# EAGLE schematic temp-stellwerk-a-2 (EAGLE 9.6.2)
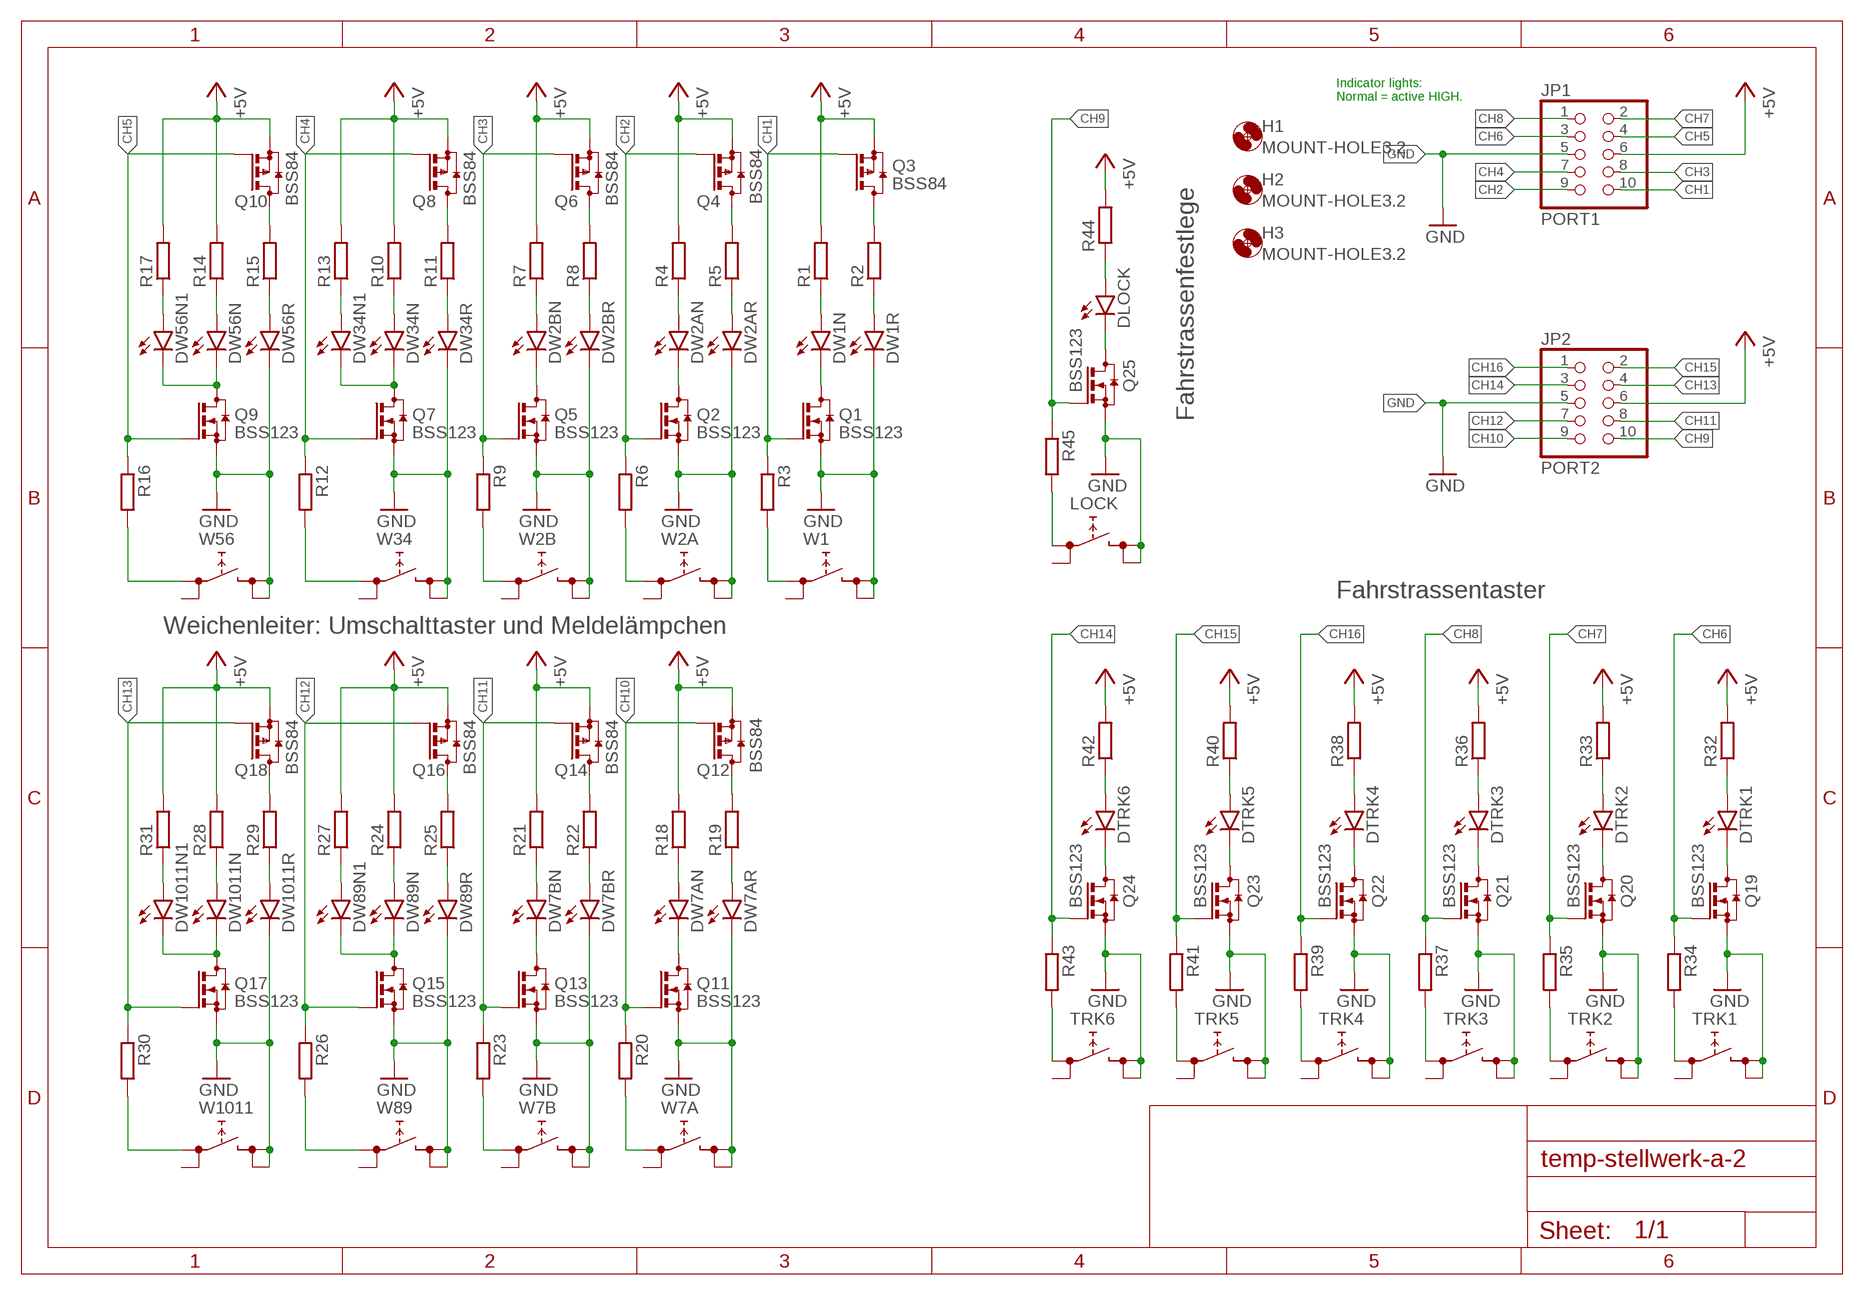
[diagram p0: schematic, sheet 1]

## Parts
DLOCK  LEDCHIP-LED0805  [CHIP-LED0805]
DTRK1  LEDCHIP-LED0805  [CHIP-LED0805]
DTRK2  LEDCHIP-LED0805  [CHIP-LED0805]
DTRK3  LEDCHIP-LED0805  [CHIP-LED0805]
DTRK4  LEDCHIP-LED0805  [CHIP-LED0805]
DTRK5  LEDCHIP-LED0805  [CHIP-LED0805]
DTRK6  LEDCHIP-LED0805  [CHIP-LED0805]
DW1N  LEDCHIP-LED0603  [CHIP-LED0603]
DW1R  LEDCHIP-LED0603  [CHIP-LED0603]
DW2AN  LEDCHIP-LED0603  [CHIP-LED0603]
DW2AR  LEDCHIP-LED0603  [CHIP-LED0603]
DW2BN  LEDCHIP-LED0805  [CHIP-LED0805]
DW2BR  LEDCHIP-LED0805  [CHIP-LED0805]
DW7AN  LEDCHIPLED_0603  [CHIPLED_0603]
DW7AR  LEDCHIP-LED0603  [CHIP-LED0603]
DW7BN  LEDCHIP-LED0805  [CHIP-LED0805]
DW7BR  LEDCHIP-LED0805  [CHIP-LED0805]
DW34N  LEDCHIP-LED0805  [CHIP-LED0805]
DW34N1  LEDCHIP-LED0805  [CHIP-LED0805]
DW34R  LEDCHIP-LED0805  [CHIP-LED0805]
DW56N  LEDCHIP-LED0805  [CHIP-LED0805]
DW56N1  LEDCHIP-LED0805  [CHIP-LED0805]
DW56R  LEDCHIP-LED0805  [CHIP-LED0805]
DW89N  LEDCHIP-LED0805  [CHIP-LED0805]
DW89N1  LEDCHIP-LED0805  [CHIP-LED0805]
DW89R  LEDCHIP-LED0805  [CHIP-LED0805]
DW1011N  LEDCHIP-LED0805  [CHIP-LED0805]
DW1011N1  LEDCHIP-LED0805  [CHIP-LED0805]
DW1011R  LEDCHIP-LED0805  [CHIP-LED0805]
H1  MOUNT-HOLE3.2  [3,2]
H2  MOUNT-HOLE3.2  [3,2]
H3  MOUNT-HOLE3.2  [3,2]
JP1  PORT1  PINHD-2X5CN  [CON10M]
JP2  PORT2  PINHD-2X5CN  [CON10M]
LOCK  LOCK  TACTSW-6X6S  [TACTSW-6X6]
Q1  BSS123  [SOT23]
Q2  BSS123  [SOT23]
Q3  BSS84  [SOT23]
Q4  BSS84  [SOT23]
Q5  BSS123  [SOT23]
Q6  BSS84  [SOT23]
Q7  BSS123  [SOT23]
Q8  BSS84  [SOT23]
Q9  BSS123  [SOT23]
Q10  BSS84  [SOT23]
Q11  BSS123  [SOT23]
Q12  BSS84  [SOT23]
Q13  BSS123  [SOT23]
Q14  BSS84  [SOT23]
Q15  BSS123  [SOT23]
Q16  BSS84  [SOT23]
Q17  BSS123  [SOT23]
Q18  BSS84  [SOT23]
Q19  BSS123  [SOT23]
Q20  BSS123  [SOT23]
Q21  BSS123  [SOT23]
Q22  BSS123  [SOT23]
Q23  BSS123  [SOT23]
Q24  BSS123  [SOT23]
Q25  BSS123  [SOT23]
R1  R-EU_R0805  [R0805]
R2  R-EU_R0805  [R0805]
R3  R-EU_R0805  [R0805]
R4  R-EU_R0805  [R0805]
R5  R-EU_R0805  [R0805]
R6  R-EU_R0805  [R0805]
R7  R-EU_R0805  [R0805]
R8  R-EU_R0805  [R0805]
R9  R-EU_R0805  [R0805]
R10  R-EU_R0805  [R0805]
R11  R-EU_R0805  [R0805]
R12  R-EU_R0805  [R0805]
R13  R-EU_R0805  [R0805]
R14  R-EU_R0805  [R0805]
R15  R-EU_R0805  [R0805]
R16  R-EU_R0805  [R0805]
R17  R-EU_R0805  [R0805]
R18  R-EU_R0805  [R0805]
R19  R-EU_R0805  [R0805]
R20  R-EU_R0805  [R0805]
R21  R-EU_R0805  [R0805]
R22  R-EU_R0805  [R0805]
R23  R-EU_R0805  [R0805]
R24  R-EU_R0805  [R0805]
R25  R-EU_R0805  [R0805]
R26  R-EU_R0805  [R0805]
R27  R-EU_R0805  [R0805]
R28  R-EU_R0805  [R0805]
R29  R-EU_R0805  [R0805]
R30  R-EU_R0805  [R0805]
R31  R-EU_R0805  [R0805]
R32  R-EU_R0805  [R0805]
R33  R-EU_R0805  [R0805]
R34  R-EU_R0805  [R0805]
R35  R-EU_R0805  [R0805]
R36  R-EU_R0805  [R0805]
R37  R-EU_R0805  [R0805]
R38  R-EU_R0805  [R0805]
R39  R-EU_R0805  [R0805]
R40  R-EU_R0805  [R0805]
R41  R-EU_R0805  [R0805]
R42  R-EU_R0805  [R0805]
R43  R-EU_R0805  [R0805]
R44  R-EU_R0805  [R0805]
R45  R-EU_R0805  [R0805]
TRK1  TACTSW-6X6S  [TACTSW-6X6]
TRK2  TACTSW-6X6S  [TACTSW-6X6]
TRK3  TACTSW-6X6S  [TACTSW-6X6]
TRK4  TACTSW-6X6S  [TACTSW-6X6]
TRK5  TACTSW-6X6S  [TACTSW-6X6]
TRK6  TACTSW-6X6S  [TACTSW-6X6]
W1  W1  TACTSW-6X6S  [TACTSW-6X6]
W2A  TACTSW-6X6S  [TACTSW-6X6]
W2B  TACTSW-6X6S  [TACTSW-6X6]
W7A  TACTSW-6X6S  [TACTSW-6X6]
W7B  TACTSW-6X6S  [TACTSW-6X6]
W34  XOVER  TACTSW-6X6S  [TACTSW-6X6]
W56  XOVER  TACTSW-6X6S  [TACTSW-6X6]
W89  XOVER  TACTSW-6X6S  [TACTSW-6X6]
W1011  XOVER  TACTSW-6X6S  [TACTSW-6X6]

## Nets
+5V: JP1.6 JP2.6 Q3.2(S) Q4.2(S) Q6.2(S) Q8.2(S) Q10.2(S) Q12.2(S) Q14.2(S) Q16.2(S) Q18.2(S) R1.2 R4.2 R7.2 R10.2 R13.2 R14.2 R17.2 R18.2 R21.2 R24.2 R27.2 R28.2 R31.2 R32.2 R33.2 R36.2 R38.2 R40.2 R42.2 R44.2
CH1: JP1.10 Q1.1(G) Q3.1(G) R3.1
CH2: JP1.9 Q2.1(G) Q4.1(G) R6.1
CH3: JP1.8 Q5.1(G) Q6.1(G) R9.1
CH4: JP1.7 Q7.1(G) Q8.1(G) R12.1
CH5: JP1.4 Q9.1(G) Q10.1(G) R16.1
CH6: JP1.3 Q19.1(G) R34.1
CH7: JP1.2 Q20.1(G) R35.1
CH8: JP1.1 Q21.1(G) R37.1
CH9: JP2.10 Q25.1(G) R45.1
CH10: JP2.9 Q11.1(G) Q12.1(G) R20.1
CH11: JP2.8 Q13.1(G) Q14.1(G) R23.1
CH12: JP2.7 Q15.1(G) Q16.1(G) R26.1
CH13: JP2.4 Q17.1(G) Q18.1(G) R30.1
CH14: JP2.3 Q24.1(G) R43.1
CH15: JP2.2 Q23.1(G) R41.1
CH16: JP2.1 Q22.1(G) R39.1
GND: DW1R.C DW2AR.C DW2BR.C DW7AR.C DW7BR.C DW34R.C DW56R.C DW89R.C DW1011R.C JP1.5 JP2.5 LOCK.3(2.1) LOCK.4(2.2) Q1.2(S) Q2.2(S) Q5.2(S) Q7.2(S) Q9.2(S) Q11.2(S) Q13.2(S) Q15.2(S) Q17.2(S) Q19.2(S) Q20.2(S) Q21.2(S) Q22.2(S) Q23.2(S) Q24.2(S) Q25.2(S) TRK1.3(2.1) TRK1.4(2.2) TRK2.3(2.1) TRK2.4(2.2) TRK3.3(2.1) TRK3.4(2.2) TRK4.3(2.1) TRK4.4(2.2) TRK5.3(2.1) TRK5.4(2.2) TRK6.3(2.1) TRK6.4(2.2) W1.3(2.1) W1.4(2.2) W2A.3(2.1) W2A.4(2.2) W2B.3(2.1) W2B.4(2.2) W7A.3(2.1) W7A.4(2.2) W7B.3(2.1) W7B.4(2.2) W34.3(2.1) W34.4(2.2) W56.3(2.1) W56.4(2.2) W89.3(2.1) W89.4(2.2) W1011.3(2.1) W1011.4(2.2)
N$1: DTRK1.C Q19.3(D)
N$2: DW1N.C Q1.3(D)
N$3: DW1N.A R1.1
N$4: DW1R.A R2.1
N$5: Q3.3(D) R2.2
N$6: DW2AN.C Q2.3(D)
N$8: R3.2 W1.1(1.1)
N$9: DW2AN.A R4.1
N$10: DW2AR.A R5.1
N$11: Q4.3(D) R5.2
N$13: R6.2 W2A.1(1.1)
N$14: DW2BN.C Q5.3(D)
N$15: DW2BN.A R7.1
N$16: DW2BR.A R8.1
N$17: Q6.3(D) R8.2
N$19: R9.2 W2B.1(1.1)
N$20: DW56N.A R14.1
N$21: DW34N.A R10.1
N$22: DW34R.A R11.1
N$23: Q8.3(D) R11.2
N$25: R12.2 W34.1(1.1)
N$26: DW34N1.C DW34N.C Q7.3(D)
N$27: DW34N1.A R13.1
N$28: DW56R.A R15.1
N$29: Q10.3(D) R15.2
N$31: R16.2 W56.1(1.1)
N$32: DW56N1.C DW56N.C Q9.3(D)
N$33: DW56N1.A R17.1
N$34: DW7AN.C Q11.3(D)
N$35: DW7AN.A R18.1
N$36: DW7AR.A R19.1
N$37: Q12.3(D) R19.2
N$39: R20.2 W7A.1(1.1)
N$40: DW7BN.C Q13.3(D)
N$41: DW7BN.A R21.1
N$42: DW7BR.A R22.1
N$43: Q14.3(D) R22.2
N$45: R23.2 W7B.1(1.1)
N$46: DW89N.A R24.1
N$47: DW89R.A R25.1
N$48: Q16.3(D) R25.2
N$50: R26.2 W89.1(1.1)
N$51: DW89N1.C DW89N.C Q15.3(D)
N$52: DW89N1.A R27.1
N$53: DW1011N.A R28.1
N$54: DW1011R.A R29.1
N$55: Q18.3(D) R29.2
N$57: R30.2 W1011.1(1.1)
N$58: DW1011N1.C DW1011N.C Q17.3(D)
N$59: DW1011N1.A R31.1
N$60: DTRK1.A R32.1
N$61: DTRK2.C Q20.3(D)
N$62: DTRK2.A R33.1
N$64: R34.2 TRK1.1(1.1)
N$66: R35.2 TRK2.1(1.1)
N$67: DTRK3.C Q21.3(D)
N$68: DTRK3.A R36.1
N$70: R37.2 TRK3.1(1.1)
N$71: DTRK4.C Q22.3(D)
N$72: DTRK4.A R38.1
N$74: R39.2 TRK4.1(1.1)
N$75: DTRK5.C Q23.3(D)
N$76: DTRK5.A R40.1
N$78: R41.2 TRK5.1(1.1)
N$79: DTRK6.C Q24.3(D)
N$80: DTRK6.A R42.1
N$82: R43.2 TRK6.1(1.1)
N$83: DLOCK.C Q25.3(D)
N$84: DLOCK.A R44.1
N$86: LOCK.1(1.1) R45.2
Unconnected: LOCK.2(1.2) TRK1.2(1.2) TRK2.2(1.2) TRK3.2(1.2) TRK4.2(1.2) TRK5.2(1.2) TRK6.2(1.2) W1.2(1.2) W2A.2(1.2) W2B.2(1.2) W7A.2(1.2) W7B.2(1.2) W34.2(1.2) W56.2(1.2) W89.2(1.2) W1011.2(1.2)

## Notes on the sheet
- Indicator lights:
  Normal = active HIGH.
- Fahrstrassenfestlege
- Fahrstrassentaster
- Weichenleiter: Umschalttaster und Meldelämpchen

## Library data of the parts
DLOCK DTRK1-DTRK6 DW1N DW1R DW2AN DW2AR DW2BN DW2BR DW7AN DW7AR DW7BN DW7BR DW34N DW34N1 DW34R DW56N DW56N1 DW56R DW89N DW89N1 DW89R DW1011N DW1011N1 DW1011R = led:LED: LED OSRAM: - CHIPLED LG R971, LG N971, LY N971, LG Q971, LY Q971, LO R971, LY R971 LH N974, LH R974 LS Q976, LO Q976, LY Q976 LO Q996 - Hyper CHIPLED LW Q18S LB Q993, LB Q99A, LB R99A - SideLED LS A670, LO A670, LY A670, LG A670, LP A670 LB A673, LV A673, LT A673, LW A673 LH A674 LY A675 LS A676, LA A676, LO A676, LY A676, LW A676 LS A679, LY A679, LG A679 - Hyper Micro SIDELED® LS Y876, LA Y876, LO Y876, LY Y876 LT Y87S - SmartLED LW L88C, LW L88S LB L89C, LB L89S, LG L890 LS L89K, LO L89K, LY L89K LS L896, LA L896, LO L896, LY L896 - TOPLED LS T670, LO T670, LY T670, LG T670, LP T670 LSG T670, LSP T670, LSY T670, LOP T670, LYG T670 LG T671, LOG T671, LSG T671 LB T673, LV T673, LT T673, LW T673 LH T674 LS T676, LA T676, LO T676, LY T676, LB T676, LH T676, LSB T676, LW T676 LB T67C, LV T67C, LT T67C, LS T67K, LO T67K, LY T67K, LW E67C LS E67B, LA E67B, LO E67B, LY E67B, LB E67C, LV E67C, LT E67C LW T67C LS T679, LY T679, LG T679 LS T770, LO T770, LY T770, LG T770, LP T770 LB T773, LV T773, LT T773, LW T773 LH T774 LS E675, LA E675, LY E675, LS T675 LS T776, LA T776, LO T776, LY T776, LB T776 LHGB T686 LT T68C, LB T68C - Hyper Mini TOPLED® LB M676 - Mini TOPLED Santana® LG M470 LS M47K, LO M47K, LY M47K Source: http://www.osram.convergy.de LUXEON: - LUMILED® LXK2-PW12-R00, LXK2-PW12-S00, LXK2-PW14-U00, LXK2-PW14-V00 LXK2-PM12-R00, LXK2-PM12-S00, LXK2-PM14-U00 LXK2-PE12-Q00, LXK2-PE12-R00, LXK2-PE12-S00, LXK2-PE14-T00, LXK2-PE14-U00 LXK2-PB12-K00, LXK2-PB12-L00, LXK2-PB12-M00, LXK2-PB14-N00, LXK2-PB14-P00, LXK2-PB14-Q00 LXK2-PR12-L00, LXK2-PR12-M00, LXK2-PR14-Q00, LXK2-PR14-R00 LXK2-PD12-Q00, LXK2-PD12-R00, LXK2-PD12-S00 LXK2-PH12-R00, LXK2-PH12-S00 LXK2-PL12-P00, LXK2-PL12-Q00, LXK2-PL12-R00 Source: www.luxeon.com KINGBRIGHT: KA-3528ASYC Source: www.kingbright.com
H1-H3 = holes:MOUNT-HOLE: MOUNTING HOLE with drill center marker
JP1 JP2 = trainlib:PINHD-2X5: PIN HEADER
LOCK TRK1-TRK6 W1 W2A W2B W7A W7B W34 W56 W89 W1011 = g-e2e-training:TACTSW-6X6: 6.2 X 6.5mm TACT Switch (SMD) Source: http://www3.alps.co.jp/WebObjects/catalog.woa/PDF/E/Switch/Tact/SKHM/SKHM.PDF
Q1 Q2 Q5 Q7 Q9 Q11 Q13 Q15 Q17 Q19-Q25 = eagleparts:BSS123: N-CHANNEL MOS FET
Q3 Q4 Q6 Q8 Q10 Q12 Q14 Q16 Q18 = transistor-small-signal:BSS84: P-CHANNEL MOS FET
R1-R45 = rcl:R-EU_: RESISTOR, European symbol; SPICEPREFIX: R

## Net classes
0 default: width 0.254 mm, clearance 0.203 mm